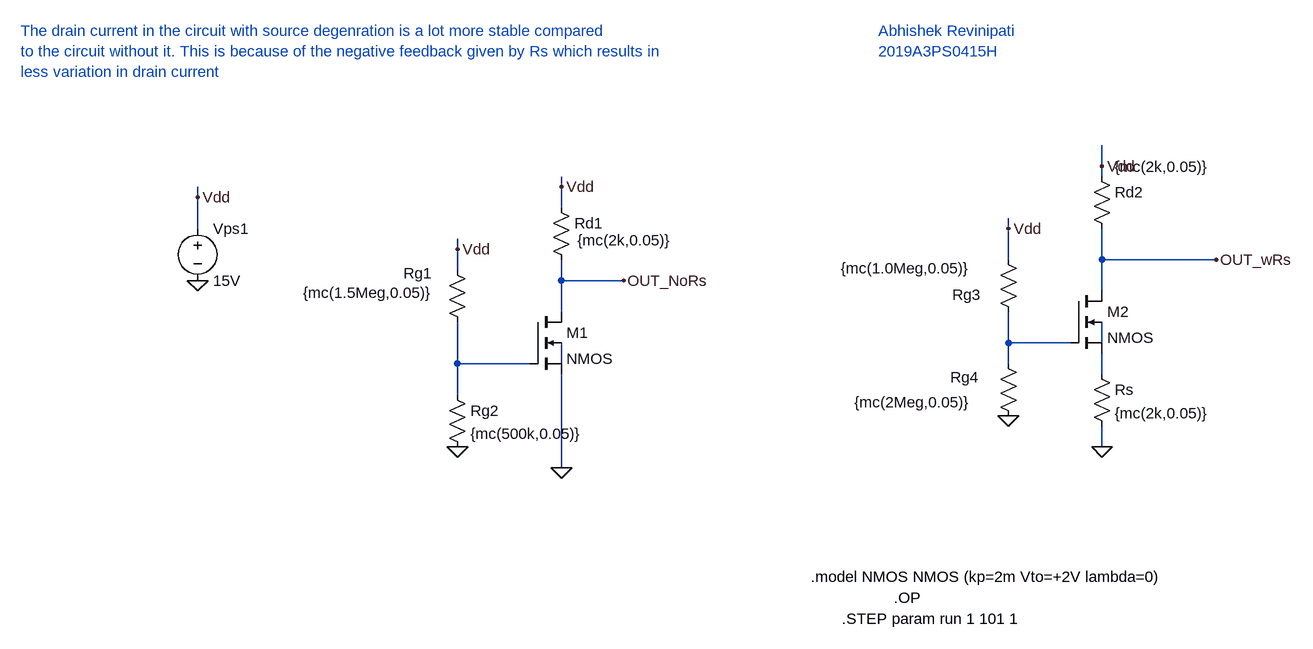
[diagram p0: schematic 2019A3PS0415H_Exp8_2.asc]
2019A3PS0415H_Exp8_2.asc, the LTspice schematic file:
Version 4
SHEET 1 1372 680
WIRE 880 -192 880 -224
WIRE 880 -176 880 -192
WIRE 48 -160 48 -176
WIRE -512 -144 -512 -160
WIRE 48 -128 48 -160
WIRE -512 -96 -512 -144
WIRE 736 -96 736 -112
WIRE -112 -64 -112 -80
WIRE 736 -48 736 -96
WIRE 880 -48 880 -96
WIRE 1056 -48 880 -48
WIRE -112 -32 -112 -64
WIRE 48 -16 48 -48
WIRE 144 -16 48 -16
WIRE 880 0 880 -48
WIRE 48 32 48 -16
WIRE 736 80 736 32
WIRE 832 80 736 80
WIRE 880 80 880 48
WIRE -112 112 -112 48
WIRE 0 112 -112 112
WIRE 48 112 48 80
WIRE 736 112 736 80
WIRE 880 128 880 96
WIRE -112 160 -112 112
WIRE 880 240 880 208
WIRE 48 272 48 128
FLAG 48 272 0
FLAG 880 240 0
FLAG 736 192 0
FLAG -112 240 0
FLAG -512 -16 0
FLAG -512 -144 Vdd
FLAG -112 -64 Vdd
FLAG 48 -160 Vdd
FLAG 736 -96 Vdd
FLAG 880 -192 Vdd
FLAG 144 -16 OUT_NoRs
FLAG 1056 -48 OUT_wRs
SYMBOL res 864 112 R0
SYMATTR InstName Rs
SYMATTR Value {mc(2k,0.05)}
SYMBOL res 32 -144 R0
WINDOW 3 41 66 Left 2
SYMATTR Value {mc(2k,0.05)}
SYMATTR InstName Rd1
SYMBOL res 864 -192 R0
WINDOW 3 36 1 Left 2
SYMATTR Value {mc(2k,0.05)}
SYMATTR InstName Rd2
SYMBOL res 720 96 R0
WINDOW 0 -73 37 Left 2
WINDOW 3 -221 75 Left 2
SYMATTR InstName Rg4
SYMATTR Value {mc(2Meg,0.05)}
SYMBOL res 720 -64 R0
WINDOW 0 -70 70 Left 2
WINDOW 3 -242 29 Left 2
SYMATTR InstName Rg3
SYMATTR Value {mc(1.0Meg,0.05)}
SYMBOL res -128 -48 R0
WINDOW 0 -67 21 Left 2
WINDOW 3 -21 51 Right 2
SYMATTR InstName Rg1
SYMATTR Value {mc(1.5Meg,0.05)}
SYMBOL res -128 144 R0
SYMATTR InstName Rg2
SYMATTR Value {mc(500k,0.05)}
SYMBOL voltage -512 -112 R0
WINDOW 123 0 0 Left 2
WINDOW 39 0 0 Left 2
SYMATTR InstName Vps1
SYMATTR Value 15V
SYMBOL nmos4 0 32 R0
SYMATTR InstName M1
SYMATTR Value2 l=100u w=100u
SYMBOL nmos4 832 0 R0
SYMATTR InstName M2
SYMATTR Value2 l=100u w=100u
TEXT 432 440 Left 2 !.model NMOS NMOS (kp=2m Vto=+2V lambda=0)
TEXT 480 504 Left 2 !.STEP param run 1 101 1
TEXT 560 472 Left 2 !.OP
TEXT -784 -400 Left 2 ;The drain current in the circuit with source degenration is a lot more stable compared\nto the circuit without it. This is because of the negative feedback given by Rs which results in \nless variation in drain current
TEXT 536 -400 Left 2 ;Abhishek Revinipati\n2019A3PS0415H

The netlist it stands for:
* 2019A3PS0415H_Exp8_2.asc
Rs N005 0 {mc(2k,0.05)}
Rd1 Vdd OUT_NoRs {mc(2k,0.05)}
Rd2 Vdd OUT_wRs {mc(2k,0.05)}
Rg4 N001 0 {mc(2Meg,0.05)}
Rg3 Vdd N001 {mc(1.0Meg,0.05)}
Rg1 Vdd N003 {mc(1.5Meg,0.05)}
Rg2 N003 0 {mc(500k,0.05)}
Vps1 Vdd 0 15V
M1 OUT_NoRs N003 0 N004 NMOS l=100u w=100u
M2 OUT_wRs N001 N005 N002 NMOS l=100u w=100u
.model NMOS NMOS
.model PMOS PMOS
.lib standard.mos
.model NMOS NMOS (kp=2m Vto=+2V lambda=0)
.STEP param run 1 101 1
.OP
* The drain current in the circuit with source degenration is a lot more stable compared
* to the circuit without it. This is because of the negative feedback given by Rs which results in
* less variation in drain current
* Abhishek Revinipati
* 2019A3PS0415H
.backanno
.end